# EAGLE design MPeV6 (EAGLE 7.5.0)
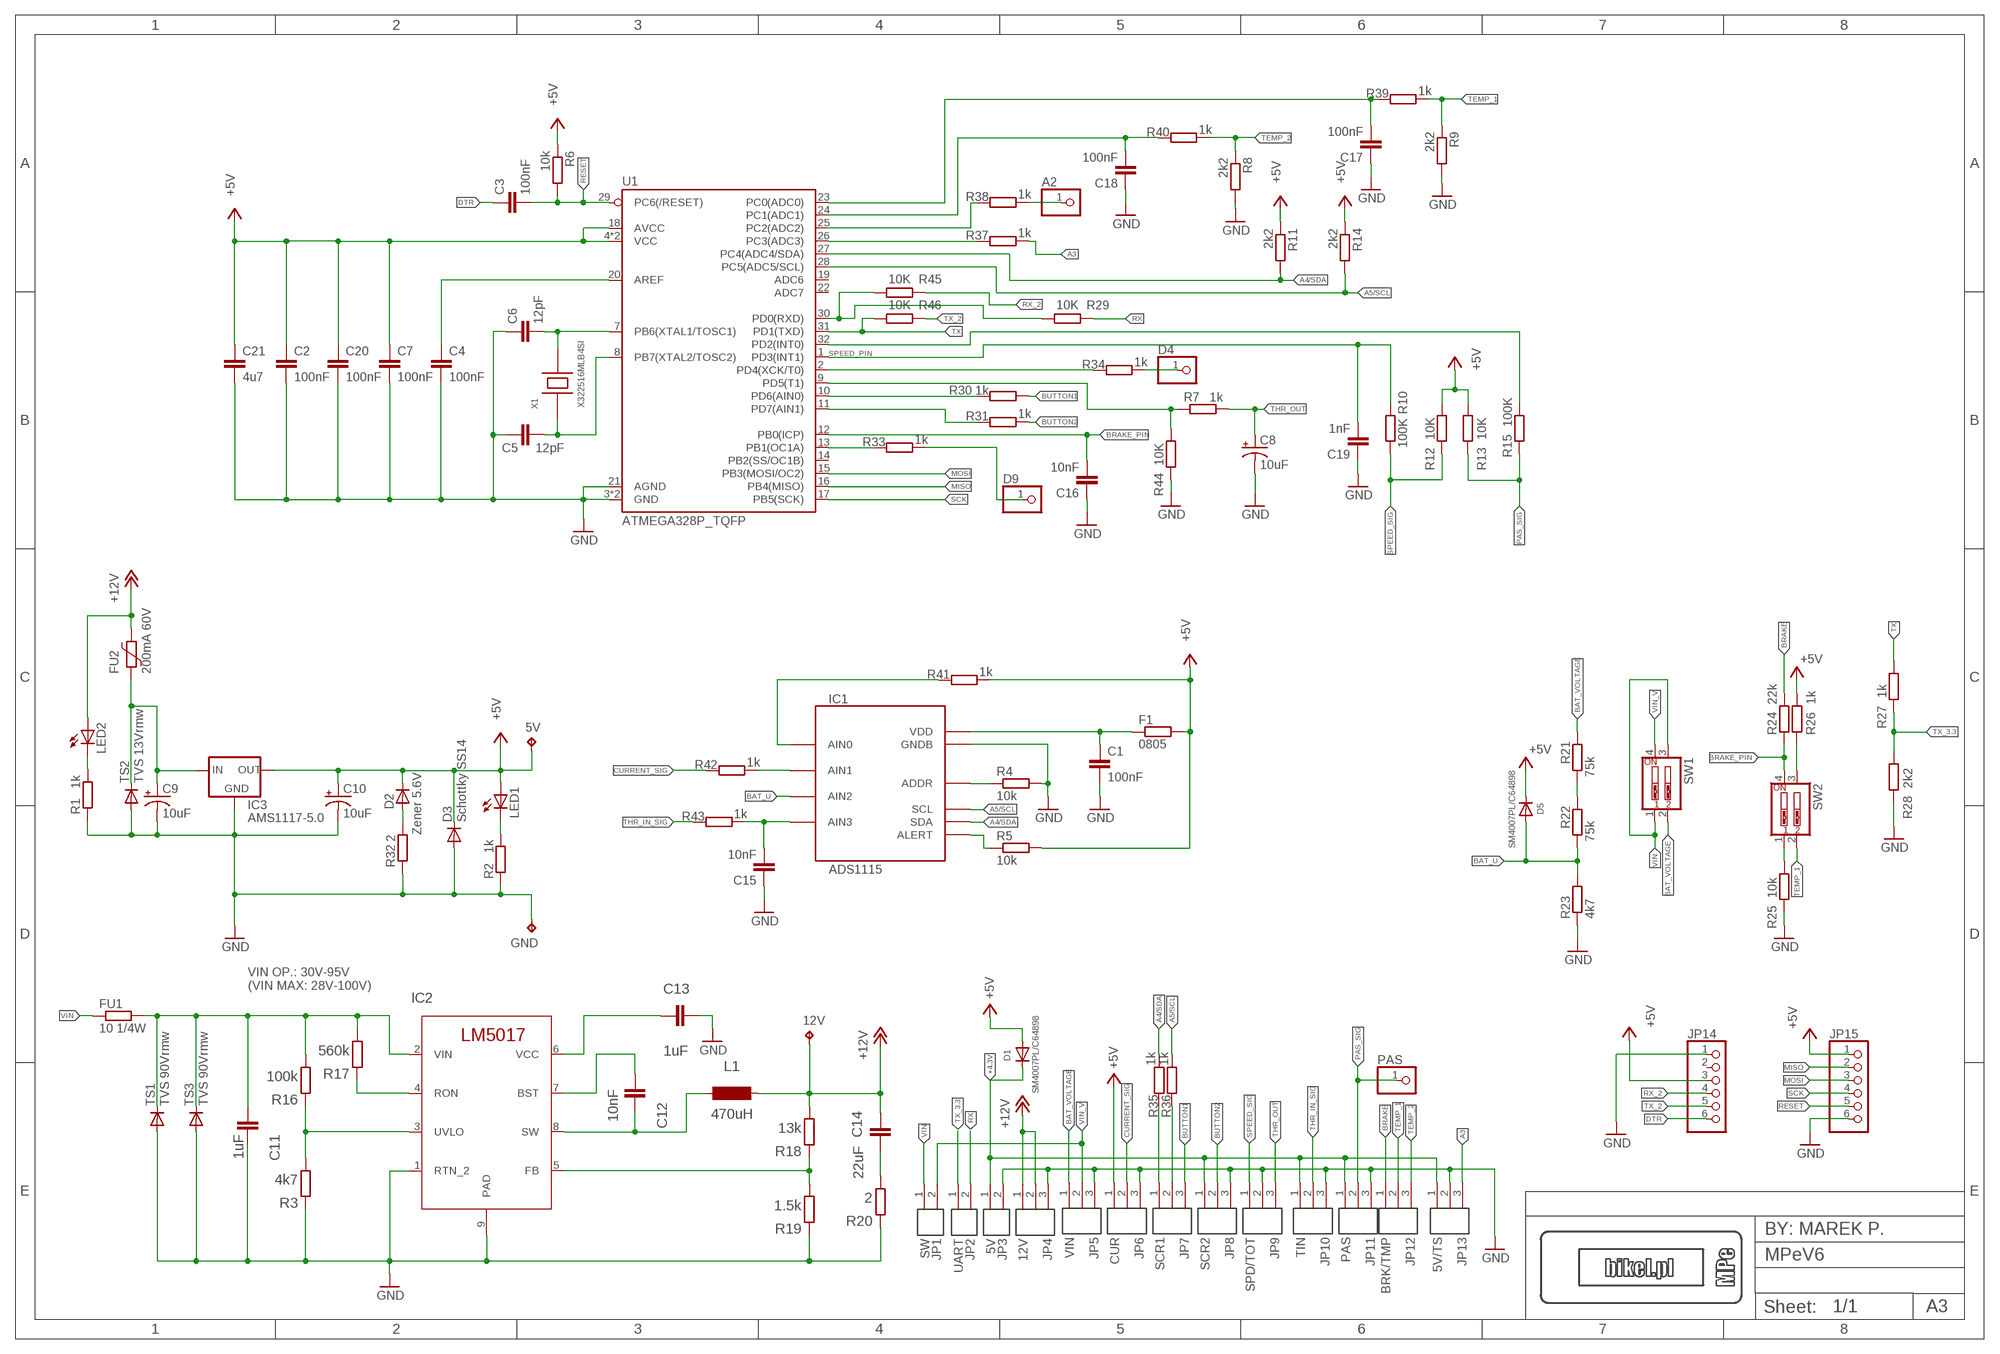
[diagram p0: schematic, sheet 1]

## Parts
5V  TP_5V  TPPAD1-13  [P1-13]
12V  TP_5V  TPPAD1-13  [P1-13]
A2  PINHD-1X1  [1X01]
C1  100nF  C-EUC0603  [C0603]
C2  100nF  C-EUC0603  [C0603]
C3  100nF  C-EUC0603  [C0603]
C4  100nF  C-EUC0603  [C0603]
C5  12pF  C-EUC0603  [C0603]
C6  12pF  C-EUC0603  [C0603]
C7  100nF  C-EUC0603  [C0603]
C8  10uF  10UF-POLAR-EIA3216-16V-10%(TANT)  [EIA3216]
C9  10uF  10UF-POLAR-EIA3216-16V-10%(TANT)  [EIA3216]
C10  10uF  10UF-POLAR-EIA3216-16V-10%(TANT)  [EIA3216]
C11  1uF  C-EUC1206  [C1206]
C12  10nF  C-EUC0805  [C0805]
C13  1uF  C-EUC0603  [C0603]
C14  22uF  C-EUC0805  [C0805]
C15  10nF  C-EUC0603  [C0603]
C16  10nF  C-EUC0603  [C0603]
C17  100nF  C-EUC0603  [C0603]
C18  100nF  C-EUC0603  [C0603]
C19  1nF  C-EUC0603  [C0603]
C20  100nF  C-EUC0603  [C0603]
C21  4u7  C-EUC0603  [C0603]
D1  SM4007PL/C64898  DIODESOD-123  [SOD-123]
D2  Zener 5.6V  D-MLL-34  [MELF-MLL34]
D3  Schottky SS14  DIODE-DO-214AC  [DO-214AC]
D4  PINHD-1X1  [1X01]
D5  SM4007PL/C64898  DIODESOD-123  [SOD-123]
D9  PINHD-1X1  [1X01]
F1  0805  R-EU_R0805  [R0805]
FU1  10 1/4W  R-EU_0204/7  [0204/7]
FU2  200mA 60V  1812L050/30  [1812L]
GND  TP_5V  TPPAD1-13  [P1-13]
IC1  ADS1115  ADS1015IDGT  [MSOP10_0.5]
IC2  LM5017MR/NOPB  [MRA08A]
IC3  AMS1117-5.0  LM1117MP-5.0  [SOT223]
JP1  SW  ARK254-2PB+  [ARK254-PB+]
JP2  UART  ARK254-2ARK254-2-COM  [ARK254-2-COM]
JP3  5V  ARK254-2ARK254-2-5V  [ARK254-2-5V]
JP4  12V  ARK254-3ARK254-3-12V-EL  [ARK254-3-12V-EL]
JP5  VIN  ARK254-3ARK254-3-VIN  [ARK254-3-VIN]
JP6  CUR  ARK254-3+S-  [ARK254-3+S-]
JP7  SCR1  ARK254-3  [ARK254-3]
JP8  SCR2  ARK254-3  [ARK254-3]
JP9  SPD/TOT  ARK254-3ARK254-3-SPD-TOT  [ARK254-3-SPD-TOT]
JP10  TIN  ARK254-3+S-  [ARK254-3+S-]
JP11  PAS  ARK254-3+S-  [ARK254-3+S-]
JP12  BRK/TMP  ARK254-3ARK254-3-BRK-TMP  [ARK254-3-BRK-TMP]
JP13  5V/TS  ARK254-3ARK254-3-5V-TS  [ARK254-3-5V-TS]
JP14  PINHD-1X6  [1X06]
JP15  PINHD-1X6  [1X06]
L1  470uH  SLF12555T-102MR34-PF  [SLF12555T-102MR34-PF]
LED1  LEDCHIP-LED0805  [CHIP-LED0805]
LED2  LEDCHIP-LED0805  [CHIP-LED0805]
PAS  PINHD-1X1  [1X01]
R1  1k  R-EU_R0603  [R0603]
R2  1k  R-EU_R0603  [R0603]
R3  4k7  R-EU_R0603  [R0603]
R4  10k  R-EU_R0603  [R0603]
R5  10k  R-EU_R0603  [R0603]
R6  10k  R-EU_R0603  [R0603]
R7  1k  R-EU_R0603  [R0603]
R8  2k2  R-EU_R0603  [R0603]
R9  2k2  R-EU_R0603  [R0603]
R10  100K  R-EU_R0603  [R0603]
R11  2k2  R-EU_R0603  [R0603]
R12  10K  R-EU_R0603  [R0603]
R13  10K  R-EU_R0603  [R0603]
R14  2k2  R-EU_R0603  [R0603]
R15  100K  R-EU_R0603  [R0603]
R16  100k  R-EU_R0603  [R0603]
R17  560k  R-EU_R0603  [R0603]
R18  13k  R-EU_R0603  [R0603]
R19  1.5k  R-EU_R0603  [R0603]
R20  2  R-EU_R0805  [R0805]
R21  75k  R-EU_R0805  [R0805]
R22  75k  R-EU_R0805  [R0805]
R23  4k7  R-EU_R0805  [R0805]
R24  22k  R-EU_R0603  [R0603]
R25  10k  R-EU_R0603  [R0603]
R26  1k  R-EU_R0603  [R0603]
R27  1k  R-EU_R0603  [R0603]
R28  2k2  R-EU_R0603  [R0603]
R29  10K  R-EU_R0603  [R0603]
R30  1k  R-EU_R0603  [R0603]
R31  1k  R-EU_R0603  [R0603]
R32  2  R-EU_R0805  [R0805]
R33  1k  R-EU_R0603  [R0603]
R34  1k  R-EU_R0603  [R0603]
R35  1k  R-EU_R0603  [R0603]
R36  1k  R-EU_R0603  [R0603]
R37  1k  R-EU_R0603  [R0603]
R38  1k  R-EU_R0603  [R0603]
R39  1k  R-EU_R0603  [R0603]
R40  1k  R-EU_R0603  [R0603]
R41  1k  R-EU_R0603  [R0603]
R42  1k  R-EU_R0603  [R0603]
R43  1k  R-EU_R0603  [R0603]
R44  10K  R-EU_R0603  [R0603]
R45  10K  R-EU_R0603  [R0603]
R46  10K  R-EU_R0603  [R0603]
SW1  SW_DIP-2  [EDG-02]
SW2  SW_DIP-2  [EDG-02]
TS1  TVS 90Vrmw  S2A  [DO214AA]
TS2  TVS 13Vrmw  S2A  [DO214AA]
TS3  TVS 90Vrmw  S2A  [DO214AA]
U1  ATMEGA328P_TQFP  [TQFP32-08]
X1  X322516MLB4SI  SMAC-3225  [IQG3225]

## Nets
3: IC2.5(FB) R18.2 R19.1
6: C13.2 IC2.6(VCC)
7: IC2.4(RON) R17.2
9: C14.2 R20.1
12V_FUSED: C9.+ FU2.2 IC3.3(IN) TS2.C
+4.3V: D1.C JP3.1 JP8.1 JP10.1 JP11.1 JP13.1
+5V: 5V.TP C2.1 C7.1 C10.+ C20.1 C21.1 D1.A D2.1(C) D3.C D5.C F1.2 IC3.2(OUT) IC3.4(OUT) JP6.1 JP14.3 JP15.1 LED1.A R5.2 R6.1 R11.1 R12.2 R13.2 R14.1 R26.2 R41.1 U1.4(VCC) U1.6(VCC) U1.18(AVCC)
+12V: 12V.TP C14.1 FU2.1 JP4.1 JP4.2 L1.P$2 LED2.A R18.1
A2: R38.2 U1.25(PC2(ADC2))
A3: JP13.3 R37.1
A4/SDA: IC1.9(SDA) R11.2 R35.1 U1.27(PC4(ADC4/SDA))
A5/SCL: IC1.10(SCL) R14.2 R36.1 U1.28(PC5(ADC5/SCL))
BAT_U: D5.A IC1.6(AIN2) R22.1 R23.2
BAT_VOLTAGE: JP5.1 R21.2 SW1.2
BRAKE: JP12.1 R24.2
BRAKE_PIN: C16.2 R24.1 SW2.4 U1.12(PB0(ICP))
BUTTON1: JP7.3 R30.1
BUTTON2: JP8.2 R31.1
CSIG: IC1.5(AIN1) R42.1
CURRENT_SIG: JP6.2 R42.2
DTR: C3.1 JP14.6
GND: C1.2 C2.2 C4.2 C5.1 C6.1 C7.2 C8.- C9.- C10.- C11.2 C13.1 C15.1 C16.1 C17.1 C18.1 C19.1 C20.2 C21.2 D3.A GND.TP IC1.3(GNDB) IC2.1(RTN_2) IC2.9(PAD) IC3.1(GND) JP3.2 JP4.3 JP5.3 JP6.3 JP8.3 JP9.2 JP10.3 JP11.3 JP13.2 JP14.1 JP15.6 R1.1 R2.1 R3.2 R4.2 R8.2 R9.2 R19.2 R20.2 R23.1 R25.1 R28.1 R32.1 R44.1 TS1.A TS2.A TS3.A U1.3(GND) U1.5(GND) U1.21(AGND)
MISO: JP15.2 U1.16(PB4(MISO))
MOSI: JP15.3 U1.15(PB3(MOSI/OC2))
N$1: LED1.C R2.2
N$2: JP7.1 R35.2
N$3: IC2.3(UVLO) R3.1 R16.2
N$4: JP7.2 R36.2
N$5: D9.1 R33.1
N$6: C12.1 IC2.7(BST)
N$7: R7.1 R44.2 U1.9(PD5(T1))
N$8: C4.1 U1.20(AREF)
N$9: LED2.C R1.2
N$10: R15.2 U1.32(PD2(INT0))
N$11: IC1.1(ADDR) R4.1
N$12: IC1.2(ALERT) R5.1
N$13: D4.1 R34.1
N$15: IC1.4(AIN0) R41.2
N$17: R29.2 R45.2 U1.30(PD0(RXD))
N$18: D2.2(A) R32.2
N$19: R25.2 SW2.1
N$20: R30.2 U1.10(PD6(AIN0))
N$21: R31.2 U1.11(PD7(AIN1))
N$22: R26.1 SW2.3
N$23: C11.1 FU1.2 IC2.2(VIN) R16.1 R17.1 TS1.C TS3.C
N$24: R33.2 U1.13(PB1(OC1A))
N$25: R34.2 U1.2(PD4(XCK/T0))
N$26: C6.2 U1.7(PB6(XTAL1/TOSC1)) X1.3(PIN2)
N$27: C5.2 U1.8(PB7(XTAL2/TOSC2)) X1.1(PIN1)
N$30: R21.1 R22.2
N$31: R37.2 U1.26(PC3(ADC3))
N$32: A2.1 R38.1
PAS_SIG: JP11.2 PAS.1 R13.1 R15.1
RESET: C3.2 JP15.5 R6.2 U1.29(PC6(/RESET))
RX: JP2.2 R29.1
RX_2: JP14.4 R45.1
SCK: JP15.4 U1.17(PB5(SCK))
SPEED_PIN: C19.2 R10.2 U1.1(PD3(INT1))
SPEED_SIG: JP9.1 R10.1 R12.1
SW: C12.2 IC2.8(SW) L1.P$1
T1: C17.2 R39.2 U1.23(PC0(ADC0))
T2: C18.2 R40.2 U1.24(PC1(ADC1))
TEMP_1: JP12.2 R9.1 R39.1 SW2.2
TEMP_2: JP12.3 R8.1 R40.1
THR_IN_SIG: JP10.2 R43.2
THR_OUT: C8.+ JP9.3 R7.2
TSIG: C15.2 IC1.7(AIN3) R43.1
TX: R27.2 R46.2 U1.31(PD1(TXD))
TX_2: JP14.5 R46.1
TX_3.3: JP2.1 R27.1 R28.2
VDD: C1.1 F1.1 IC1.8(VDD)
VIN: FU1.1 JP1.1 SW1.1 SW1.3
VIN_V: JP1.2 JP5.2 SW1.4
Unconnected: JP14.2 U1.14(PB2(SS/OC1B)) U1.19(ADC6) U1.22(ADC7)

## Notes on the sheet
- VIN OP.: 30V-95V
  (VIN MAX: 28V-100V)

## Library data of the parts
5V 12V GND = testpad:TP: Test pad
A2 D4 D9 PAS = pinhead:PINHD-1X1: PIN HEADER
C1-C7 C11-C21 = resistor:C-EU: CAPACITOR, European symbol
C8-C10 = SparkFun-Capacitors:10UF-POLAR: 10.0µF polarized capacitors A capacitor is a passive two-terminal electrical component used to store electrical energy temporarily in an electric field.; PROD_ID: CAP-00811
D1 D5 = adafruit:DIODE: Diode SMADIODE - SMA Surface Mount Package 20V 1A Schottky Diode Digikey: 641-1014-6-ND DO-1N4148 - Through Hole Small Current Diode SOD-123 20V 1 A (.5mV Vf) Schottky Diode - Digikey: MBRX120TPMSCT-ND SOD-323 10V 570mA (.38mV Vf, 3ns) Schottky Diode - Digikey: ZLLS410CT-ND SOD-523 30V 30mA Schottky Diode (RB751S-40TE61) - Digikey: RB751S-40TE61CT-ND SOT23-R/W - SOT23 Package (R = Solder Paste/Reflow Ovens, W = Hand-Soldering) BAT54Film 40V 300mA - Digikey: 497-7162-1-ND
D2 = semicon-smd-ipc:D-: DIODE unfilled
D3 = diode:DIODE-: DIODE
F1 FU1 R1-R46 = resistor:R-EU_: RESISTOR, European symbol
FU2 = polyfuse-smd_10:?: Polyfuse Resettable PTC Source: http://www.littelfuse.com/products/resettable-ptcs.aspx; MF: Littelfuse; MPN: 1812L050/30; OC_FARNELL: 2383301; OC_NEWARK: 64R8225
IC1 = bt_adc:ADS1015: Ti ADS1015 12-bit ADC Ultra-Small, Low-Power, 12-Bit Analog-to-Digital Converter with Internal Reference The ADS1013, ADS1014, and ADS1015 are precision analog-to-digital converters (ADCs) with 12 bits of resolution offered in an ultra-small, leadless QFN-10 package or an MSOP-10 package. \ Source: http://focus.ti.com/docs/prod/folders/print/ads1015.html
IC2 = _LM5017_export:LM5017MR/NOPB; DATASHEETURL: httpwww.ti.comproductlm34927; FREQUENCY: 1000000.0; IMAX: 0.6; MANUFACTURER_NAME: Texas Instruments; MANUFACTURER_PART_NUMBER: LM5017MRNOPB; MKTG_PACKAGE: NA; NSID: LM5017SDNOPB; PACKAGE: NA; VENDOR: Texas Instruments
IC3 = lm1117:LM1117?-*: 800mA Low-Dropout Linear Regulator Source: http://ww1.microchip.com/downloads/en/DeviceDoc/39760d.pdf; MF: Texas Instruments; MPN: LM1117MP-5.0; OC_FARNELL: 9778209; OC_NEWARK: 28X3417
JP1-JP3 = _marek:ARK254-2
JP4-JP13 = _marek:ARK254-3
JP14 JP15 = pinhead:PINHD-1X6: PIN HEADER
L1 = _marek:SLF12555T-102MR34-PF; LCSC: C13738
LED1 LED2 = adafruit:LED: LED OSRAM: - CHIPLED LG R971, LG N971, LY N971, LG Q971, LY Q971, LO R971, LY R971 LH N974, LH R974 LS Q976, LO Q976, LY Q976 LO Q996 - Hyper CHIPLED LW Q18S LB Q993, LB Q99A, LB R99A - SideLED LS A670, LO A670, LY A670, LG A670, LP A670 LB A673, LV A673, LT A673, LW A673 LH A674 LY A675 LS A676, LA A676, LO A676, LY A676, LW A676 LS A679, LY A679, LG A679 - Hyper Micro SIDELED® LS Y876, LA Y876, LO Y876, LY Y876 LT Y87S - SmartLED LW L88C, LW L88S LB L89C, LB L89S, LG L890 LS L89K, LO L89K, LY L89K LS L896, LA L896, LO L896, LY L896 - TOPLED LS T670, LO T670, LY T670, LG T670, LP T670 LSG T670, LSP T670, LSY T670, LOP T670, LYG T670 LG T671, LOG T671, LSG T671 LB T673, LV T673, LT T673, LW T673 LH T674 LS T676, LA T676, LO T676, LY T676, LB T676, LH T676, LSB T676, LW T676 LB T67C, LV T67C, LT T67C, LS T67K, LO T67K, LY T67K, LW E67C LS E67B, LA E67B, LO E67B, LY E67B, LB E67C, LV E67C, LT E67C LW T67C LS T679, LY T679, LG T679 LS T770, LO T770, LY T770, LG T770, LP T770 LB T773, LV T773, LT T773, LW T773 LH T774 LS E675, LA E675, LY E675, LS T675 LS T776, LA T776, LO T776, LY T776, LB T776 LHGB T686 LT T68C, LB T68C - Hyper Mini TOPLED® LB M676 - Mini TOPLED Santana® LG M470 LS M47K, LO M47K, LY M47K Source: http://www.osram.convergy.de/
SW1 SW2 = special:SW_DIP-2: DIP SWITCH
TS1-TS3 = s2x_10:S2*: S2A - S2M General Purpose Rectifiers Source: http://www.fairchildsemi.com/datasheets/S2/S2A.pdf; MF: Fairchild; MPN: S2A; OC_FARNELL: 1467485; OC_NEWARK: 58K2391
U1 = SparkFun-IC-Microcontroller:ATMEGA328P_TQFP: Popular 328P in QFP Storefront component: ATmega328 - TQFP <https://www.sparkfun.com/products/13448> (COM-13448) Datasheet <http://www.sparkfun.com/datasheets/Components/SMD/ATMega328.pdf> SparkFun Products SparkFun RedBoard - Programmed with Arduino <https://www.sparkfun.com/products/12757> (DEV-12757) Arduino Pro Mini 328 - 5V/16MHz <https://www.sparkfun.com/products/11113> (DEV-11113) Arduino Pro Mini 328 - 3.3V/8MHz <https://www.sparkfun.com/products/11114> (DEV-11114) SparkFun OpenLog <https://www.sparkfun.com/products/13712> (DEV-13712) SparkFun MicroView - OLED Arduino Module <https://www.sparkfun.com/products/12923> (DEV-12923) SparkFun Digital Sandbox <https://www.sparkfun.com/products/12651> (DEV-12651) SparkFun PicoBoard <https://www.sparkfun.com/products/11888> (WIG-11888) Arduino Fio <https://www.sparkfun.com/products/10116> (DEV-10116) LilyPad Arduino 328 Main Board <https://www.sparkfun.com/products/13342> (DEV-13342) SparkFun RedStick <https://www.sparkfun.com/products/13741> (DEV-13741) LilyPad MP3 <https://www.sparkfun.com/products/11013> (DEV-11013) LilyPad Arduino SimpleSnap <https://www.sparkfun.com/products/10941> (DEV-10941) SparkFun Stepoko <https://www.sparkfun.com/products/13899> (ROB-13899) SparkFun Geiger Counter <https://www.sparkfun.com/products/11345> (SEN-11345) SparkFun EL Sequencer <https://www.sparkfun.com/products/12781> (COM-12781) Arduino Pro 328 - 5V/16MHz <https://www.sparkfun.com/products/10915> (DEV-10915) CryptoCape <https://www.sparkfun.com/products/12773> (DEV-12773) SparkFun IR Thermometer Evaluation Board - MLX90614 <https://www.sparkfun.com/products/10740> (SEN-10740) SparkFun RedBot Mainboard <https://www.sparkfun.com/products/12097> (ROB-12097) Arduino Pro 328 - 3.3V/8MHz <https://www.sparkfun.com/products/10914> (DEV-10914) SparkFun Block for Intel® Edison - Arduino <https://www.sparkfun.com/products/13036> (DEV-13036) SparkFun Simon Says - Surface Mount Soldering Kit <https://www.sparkfun.com/products/10935> (KIT-10935) SparkFun 7-Segment Serial Display - Red <https://www.sparkfun.com/products/11441> (COM-11441) SparkFun 7-Segment Serial Display - White <https://www.sparkfun.com/products/11629> (COM-11629) SparkFun 7-Segment Serial Display - Yellow <https://www.sparkfun.com/products/11443> (COM-11443) SparkFun 7-Segment Serial Display - Kelly Green <https://www.sparkfun.com/products/11440> (COM-11440) SparkFun 7-Segment Serial Display - Blue <https://www.sparkfun.com/products/11442> (COM-11442) SparkFun OpenSegment Serial Display - 20mm (Blue) <https://www.sparkfun.com/products/11647> (COM-11647) SparkFun OpenSegment Serial Display - 20mm (Green) <https://www.sparkfun.com/products/11646> (COM-11646) SparkFun OpenSegment Serial Display - 20mm (White) <https://www.sparkfun.com/products/11648> (COM-11648) SparkFun OpenSegment Serial Display - 20mm (Red) <https://www.sparkfun.com/products/11644> (COM-11644) SparkFun OpenSegment Serial Display - 20mm (Yellow) <https://www.sparkfun.com/products/11645> (COM-11645) SparkFun OpenSegment Shield <https://www.sparkfun.com/products/13190> (DEV-13190); PROD_ID: IC-09069
X1 = interquip:SMAC-3225: All Ceramic SMD Package SMAC-3225 4Pads Pb-Free, RoHs Compliant Company Website:http://www.interquip.com/

## Board
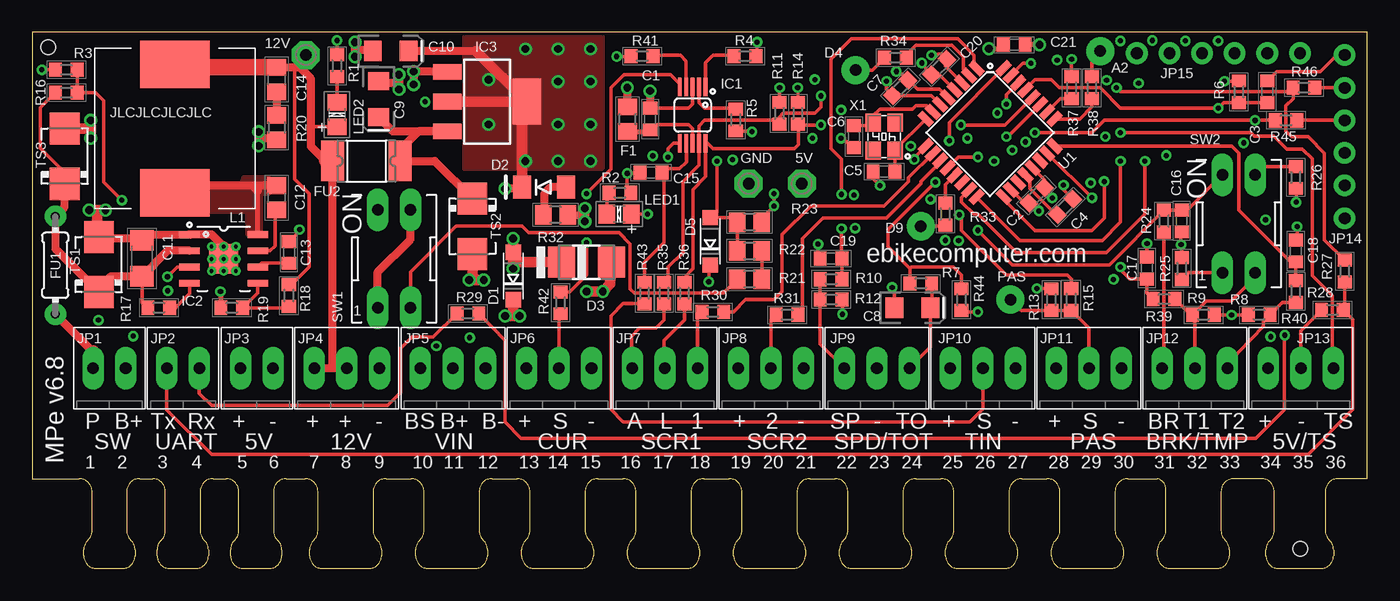
[diagram p1: board, top side]
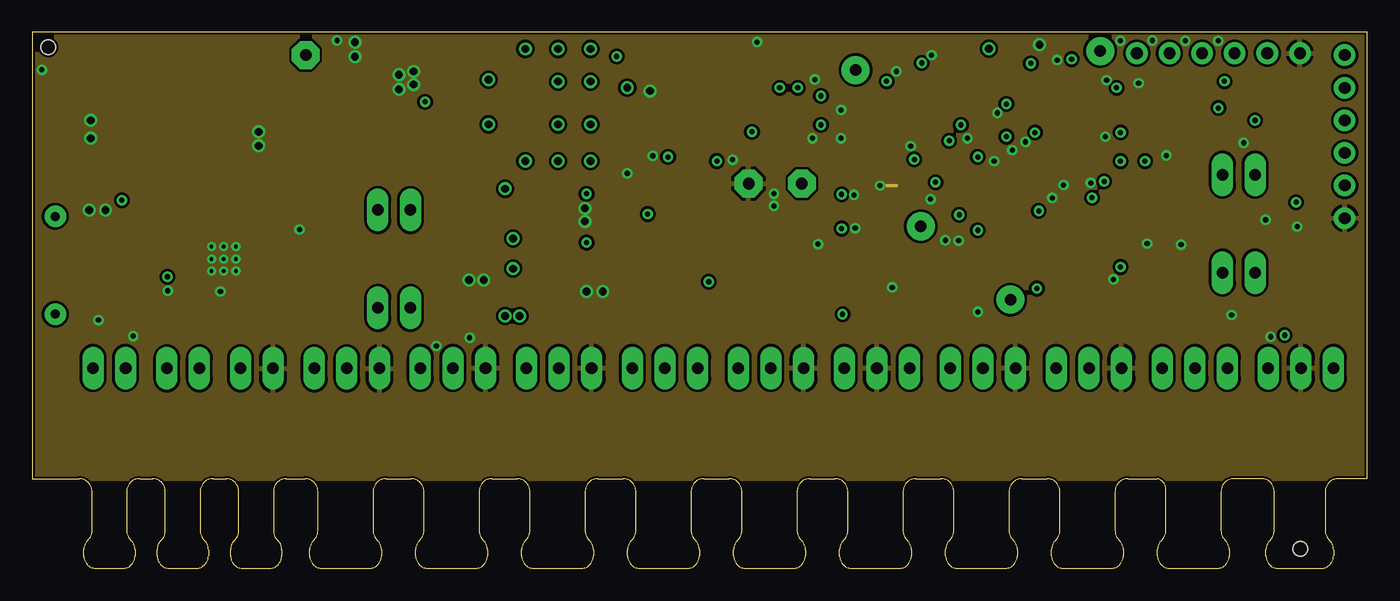
[diagram p2: board, inner layer GND]
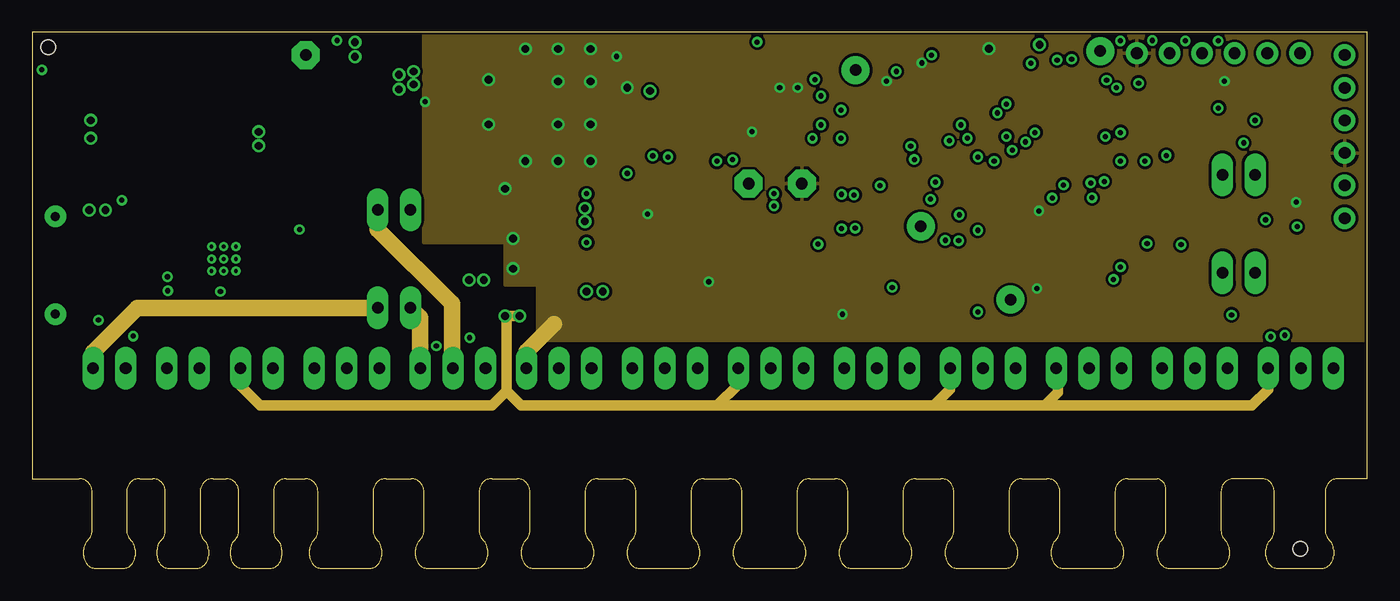
[diagram p3: board, inner layer Power_5V]
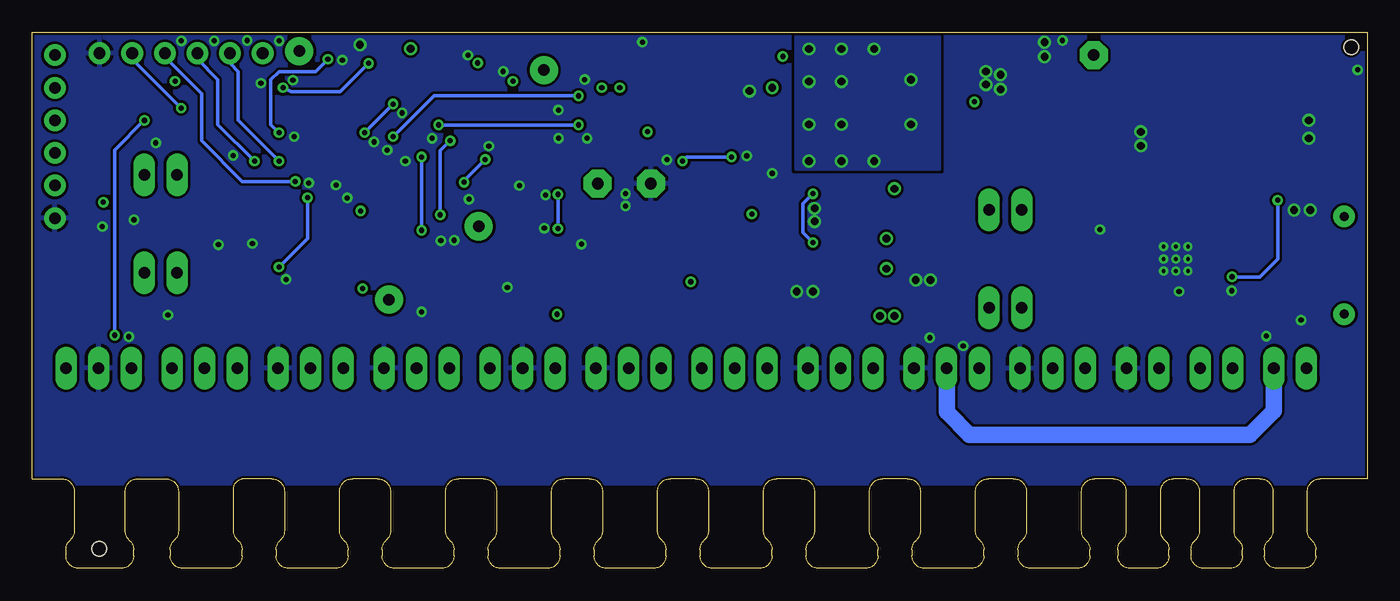
[diagram p4: board, bottom side, seen from below]

Size 104 x 41.8 mm. Coordinates in mm from the lower left corner, seen from the top.
Outline: 104,7 104,41.8 0,41.8 0,7 3.67,7 arc-90 4.67,6 4.67,2.94 arc-48 4.34,2.2 arc48 4.02,1.46 4.02,1 arc90 5.02,0 7.02,0 arc90 8.02,1 8.02,1.46 arc48 7.69,2.2 arc-48 7.37,2.94 7.37,6 arc-90 8.37,7 9.38,7 arc-90 10.38,6 10.38,2.94 arc-48 10.06,2.2 arc48 9.73,1.46 9.73,1 arc90 10.73,0 12.73,0 arc90 13.73,1 13.73,1.46 arc48 13.41,2.2 arc-48 13.08,2.94 13.08,6 arc-90 14.08,7 15.1,7 arc-90 16.1,6 16.1,2.94 arc-48 15.77,2.2 arc48 15.45,1.46 15.45,1 arc90 16.45,0 18.45,0 arc90 19.45,1 19.45,1.46 arc48 19.12,2.2 arc-48 18.8,2.94 18.8,6 arc-90 19.8,7 21.26,7 arc-90 22.26,6 22.26,2.94 arc-48 21.94,2.2 arc48 21.61,1.46 21.61,1 arc90 22.61,0 26.21,0 arc90 27.21,1 27.21,1.46 arc48 26.89,2.2 arc-48 26.56,2.94 26.56,6 arc-90 27.56,7 29.52,7 arc-90 30.52,6 30.52,2.94 arc-48 30.19,2.2 arc48 29.87,1.46 29.87,1 arc90 30.87,0 34.47,0 arc90 35.47,1 35.47,1.46 arc48 35.14,2.2 arc-48 34.82,2.94 34.82,6 arc-90 35.82,7 37.77,7 arc-90 38.77,6 38.77,2.94 arc-48 38.45,2.2 arc48 38.12,1.46 38.12,1 arc90 39.12,0 42.72,0 arc90 43.72,1 43.72,1.46 arc48 43.4,2.2 arc-48 43.07,2.94 43.07,6 arc-90 44.07,7 46.03,7 arc-90 47.03,6 47.03,2.94 arc-48 46.7,2.2 arc48 46.38,1.46 46.38,1 arc90 47.38,0 50.98,0 arc90 51.98,1 51.98,1.46 arc48 51.65,2.2 arc-48 51.33,2.94 51.33,6 arc-90 52.33,7 54.28,7 arc-90 55.28,6 55.28,2.94 arc-48 54.96,2.2 arc48 54.63,1.46 54.63,1 arc90 55.63,0 59.23,0 arc90 60.23,1 60.23,1.46 arc48 59.91,2.2 arc-48 59.58,2.94 59.58,6 arc-90 60.58,7 62.54,7 arc-90 63.54,6 63.54,2.94 arc-48 63.21,2.2 arc48 62.89,1.46 62.89,1 arc90 63.89,0 67.49,0 arc90 68.49,1 68.49,1.46 arc48 68.16,2.2 arc-48 67.84,2.94 67.84,6 arc-90 68.84,7 70.79,7 arc-90 71.79,6 71.79,2.94 arc-48 71.47,2.2 arc48 71.14,1.46 71.14,1 arc90 72.14,0 75.74,0 arc90 76.74,1 76.74,1.46 arc48 76.42,2.2 arc-48 76.09,2.94 76.09,6 arc-90 77.09,7 79.05,7 arc-90 80.05,6 80.05,2.94 arc-48 79.72,2.2 arc48 79.4,1.46 79.4,1 arc90 80.4,0 84,0 arc90 85,1 85,1.46 arc48 84.67,2.2 arc-48 84.35,2.94 84.35,6 arc-90 85.35,7 87.62,7 arc-90 88.3,6 88.3,2.94 arc-48 87.98,2.2 arc48 87.65,1.46 87.65,1 arc90 88.65,0 92.25,0 arc90 93.25,1 93.25,1.46 arc48 92.93,2.2 arc-48 92.6,2.94 92.6,6 arc-90 93.6,7 95.74,7 arc-90 96.74,6 96.74,2.94 arc-48 96.42,2.2 arc48 96.09,1.46 96.09,1 arc90 97.09,0 100.36,0 arc90 101.36,1 101.36,1.46 arc48 101.04,2.2 arc-48 100.71,2.94 100.71,6 arc-90 101.71,7 104,7
Copper layers (1*2*3*16): Top 0.035mm / dielectric 0.2mm / GND 0.035mm / dielectric 1.065mm / Power_5V 0.035mm / dielectric 0.2mm / Bottom 0.035mm
Design rules "default *": minimum track width 5mil, minimum drill 0.2mm, track to track 5mil, track to pad 5mil, pad to pad 5mil, via to via 5mil, smd to smd 5mil, copper to edge 8mil, drill to drill 8mil, minimum pad ring 10mil, minimum via ring 8mil, stop-mask expansion 4mil, vias tented up to drill 0.6mm, thermal gap 10mil
Holes 1.15 mm at 1.27,40.64 98.77,1.53

### Footprints (pad centres in the part's own frame; a part is rotated, then mirrored left to right if it is on the bottom)
P1-13 = drill 0.9 pad 2.159 octagon: TP 0,0
1X01 = drill 0.9 pad 2.184: 1 0,0
C0603 = smd 1 x 1.1: 1 -0.85,0; 2 0.85,0
EIA3216 = smd 1.4 x 1.6: + 1.4,0; - -1.4,0
C1206 = smd 1.6 x 1.8: 1 -1.4,0; 2 1.4,0
C0805 = smd 1.3 x 1.5: 1 -0.95,0; 2 0.95,0
SOD-123 = smd 1.2 x 1.2: A 1.85,0; C -1.85,0
MELF-MLL34 = smd 1.4 x 1.8: 1 -1.7,0; 2 1.7,0
DO-214AC = smd 2.1 x 2.4: A 1.95,0; C -1.95,0
R0805 = smd 1.3 x 1.5: 1 -0.95,0; 2 0.95,0
0204/7 = drill 0.7 pad 1.676: 1 -3.81,0; 2 3.81,0
1812L = smd 1.78 x 3.15: 1 -2.62,0; 2 2.62,0
MSOP10_0.5 = smd 0.3 x 1.45: 1 -1,-2.2; 2 -0.5,-2.2; 3 0,-2.2; 4 0.5,-2.2; 5 1,-2.2; 6 1,2.2; 7 0.5,2.2; 8 0,2.2; 9 -0.5,2.2; 10 -1,2.2
MRA08A = smd 1.6 x 0.533: 1 -2.654,1.905; 2 -2.654,0.635; 3 -2.654,-0.635; 4 -2.654,-1.905; 5 2.654,-1.905; 6 2.654,-0.635; 7 2.654,0.635; 8 2.654,1.905 | smd 2.286 x 2.286: 9 0,0
SOT223 = smd 1.219 x 2.235: 1 -2.311,-3.099; 2 0,-3.099; 3 2.311,-3.099 | smd 3.6 x 2.2: 4 0,3.099
ARK254-PB+ = drill 0.9 pad 1.676 long: 1 -1.27,0; 2 1.27,0
ARK254-2-COM = drill 0.9 pad 1.676 long: 1 -1.27,0; 2 1.27,0
ARK254-2-5V = drill 0.9 pad 1.676 long: 1 -1.27,0; 2 1.27,0
ARK254-3-12V-EL = drill 0.9 pad 1.676 long: 1 -2.54,0; 2 0,0; 3 2.54,0
ARK254-3-VIN = drill 0.9 pad 1.676 long: 1 -2.54,0; 2 0,0; 3 2.54,0
ARK254-3+S- = drill 0.9 pad 1.676 long: 1 -2.54,0; 2 0,0; 3 2.54,0
ARK254-3 = drill 0.9 pad 1.676 long: 1 -2.54,0; 2 0,0; 3 2.54,0
ARK254-3-SPD-TOT = drill 0.9 pad 1.676 long: 1 -2.54,0; 2 0,0; 3 2.54,0
ARK254-3-BRK-TMP = drill 0.9 pad 1.676 long: 1 -2.54,0; 2 0,0; 3 2.54,0
ARK254-3-5V-TS = drill 0.9 pad 1.676 long: 1 -2.54,0; 2 0,0; 3 2.54,0
1X06 = drill 0.9 pad 1.676: 1 -6.35,0; 2 -3.81,0; 3 -1.27,0; 4 1.27,0; 5 3.81,0; 6 6.35,0
SLF12555T-102MR34-PF = smd 3.7 x 5.4: P$1 -5,0; P$2 5,0
CHIP-LED0805 = smd 1.5 x 1.3: A 0,-0.95; C 0,0.95
R0603 = smd 1 x 1.1: 1 -0.85,0; 2 0.85,0
EDG-02 = drill 0.9 pad 1.676 long: 1 -1.27,-3.81; 2 1.27,-3.81; 3 1.27,3.81; 4 -1.27,3.81
DO214AA = smd 2.5 x 2.3: A 2.15,0; C -2.15,0
TQFP32-08 = smd 1.27 x 0.559: 1 -4.293,2.8; 2 -4.293,2; 3 -4.293,1.2; 4 -4.293,0.4; 5 -4.293,-0.4; 6 -4.293,-1.2; 7 -4.293,-2; 8 -4.293,-2.8; 17 4.293,-2.8; 18 4.293,-2; 19 4.293,-1.2; 20 4.293,-0.4; 21 4.293,0.4; 22 4.293,1.2; 23 4.293,2; 24 4.293,2.8 | smd 0.559 x 1.27: 9 -2.8,-4.293; 10 -2,-4.293; 11 -1.2,-4.293; 12 -0.4,-4.293; 13 0.4,-4.293; 14 1.2,-4.293; 15 2,-4.293; 16 2.8,-4.293; 25 2.8,4.293; 26 2,4.293; 27 1.2,4.293; 28 0.4,4.293; 29 -0.4,4.293; 30 -1.2,4.293; 31 -2,4.293; 32 -2.8,4.293
IQG3225 = smd 1.4 x 1.2: 1 -1.1,-0.85; 2 1.1,-0.85; 3 1.1,0.85; 4 -1.1,0.85

### Placement (x,y rotation side)
5V  59.96,29.99 0 top
12V  21.31,40 0 top
A2  83.19,40.32 0 top
C1  48.15,35.02 90 top
C2  78.23,29.08 45 top
C3  96.2,37.14 270 top
C4  80.47,28.18 45 top
C5  66.36,30.92 0 top
C6  64.01,33.65 90 top
C7  67.63,37.46 45 top
C8  68.58,20.32 0 top
C9  26.99,36.57 270 top
C10  27.94,40.32 0 top
C11  8.56,24.16 90 top
C12  19.05,28.89 90 top
C13  20,24.63 270 top
C14  19.05,38.1 270 top
C15  48.21,30.84 0 top
C16  89.53,27.09 90 top
C17  86.82,23.42 270 top
C18  98.42,24.75 270 top
C19  62.23,24.15 0 top
C20  70.66,39.09 45 top
C21  76.49,40.8 0 top
D1  37.47,22.79 90 top
D2  39.88,29.71 0 top
D3  43.18,23.87 0 top
D4  64.14,38.85 0 top
D5  52.81,25.5 90 top
D9  69.22,26.67 0 top
F1  46.37,35.01 90 top
FU1  1.8,23.63 90 top
FU2  26.04,31.75 0 top
GND  55.8,29.99 0 top
IC1  51.45,35.33 180 top
IC2  14.92,24.13 0 top
IC3  35.43,36.38 270 top
JP1  6.02,15.62 0 top
JP2  11.76,15.6 0 top
JP3  17.5,15.6 0 top
JP4  24.51,15.6 0 top
JP5  32.78,15.62 0 top
JP6  41.03,15.62 0 top
JP7  49.29,15.62 0 top
JP8  57.54,15.62 0 top
JP9  65.8,15.62 0 top
JP10  74.05,15.62 0 top
JP11  82.31,15.62 0 top
JP12  90.56,15.62 0 top
JP13  98.82,15.62 0 top
JP14  102.23,33.65 90 top
JP15  92.39,40.15 0 top
L1  11.11,34.29 90 top
LED1  45.72,27.62 90 top
LED2  23.75,35.37 0 top
PAS  76.2,20.95 0 top
R1  23.75,39.18 270 top
R2  45.78,29.27 180 top
R3  2.67,38.86 180 top
R4  55.52,39.93 0 top
R5  54.8,34.95 270 top
R6  93.98,37.14 270 top
R7  69.22,22.22 0 top
R8  95.57,19.77 180 top
R9  91.24,19.77 0 top
R10  62.23,22.54 0 top
R11  58.22,35.47 270 top
R12  62.23,20.95 0 top
R13  79.38,20.95 90 top
R14  59.64,35.47 270 top
R15  80.92,20.96 90 top
R16  2.67,37.08 0 top
R17  9.87,20.32 0 top
R18  20,21.27 270 top
R19  15.56,20.32 180 top
R20  19.05,34.35 270 top
R21  55.88,22.54 180 top
R22  55.88,24.76 0 top
R23  55.88,26.98 180 top
R24  88.15,27.07 270 top
R25  89.53,23.38 270 top
R26  98.42,30.48 270 top
R27  102.23,23.17 90 top
R28  101.28,20.14 0 top
R29  33.95,19.88 0 top
R30  53.02,20 0 top
R31  58.8,19.77 0 top
R32  40.77,27.56 180 top
R33  71.12,27.62 90 top
R34  67.25,39.81 0 top
R35  49.23,21.46 270 top
R36  50.8,21.46 270 top
R37  80.96,37.46 270 top
R38  82.55,37.46 270 top
R39  88.16,20.99 180 top
R40  98.42,21.59 90 top
R41  47.51,39.93 0 top
R42  41.15,20.7 270 top
R43  47.69,21.46 270 top
R44  72.39,20.95 90 top
R45  97.66,34.92 180 top
R46  99.06,37.46 180 top
SW1  28.19,24.13 0 top
SW2  93.98,26.87 0 top
TS1  5.19,23.68 90 top
TS2  34.29,26.67 270 top
TS3  2.54,32.13 90 top
U1  74.61,33.97 315 top
X1  66.36,33.65 90 top

### Tracks (layer width: path | path; a pad name or v marks a point on that pad's centre or on a via)
3
  Top 0.254: IC2.5 17.58,21.49 R19.1 19.9,20.32 R18.2
6
  Top 0.254: IC2.6 17.87,23.78 C13.2
7
  Top 0.254: IC2.4 12.27,21.45 11.14,20.32
  Top 0.406: R17.2 11.14,20.32
9
  Top 0.61: C14.2 R20.1
12V_FUSED
  Top 0.61: FU2.2 31.36,31.75 TS2.C | 28.26,32.22 30.11,34.07 IC3.3 28.09,34.07 C9.+
  Top 1.016: FU2.2 28.26,32.22
+4.3V  (via drill 0.6)
  Top 0.813: v37.97,19.68 v36.83,19.68 37.47,19.68 D1.C
  Power_5V 0.813: v37.97,19.68 36.96,19.68 36.96,13.84 | 36.96,13.84 35.81,12.7 17.78,12.7 16.23,14.25 JP3.1 | 36.96,13.84 38.1,12.7 53.34,12.7 | 53.34,12.7 55,14.36 JP8.1 | JP10.1 71.5,15.6 71.5,13.97 70.23,12.7 | 70.23,12.7 53.34,12.7 | JP11.1 79.88,15.5 79.88,13.71 78.87,12.7 | 78.87,12.7 70.23,12.7 | JP13.1 96.27,15.6 96.27,13.97 95,12.7 78.87,12.7
+5V  (via drill 0.4, 0.6)
  Top 0.254: U1.6 70.02,36.86 C7.1 66.55,37.34 v66.55,37.97 | 71.68,37.29 U1.4 70.53,38.61 C20.1 69.6,38.95 v69.29,39.39 | U1.18 77.28,28.48 C2.1 77.79,28.48 v78.41,27.86 | LED1.A v47.94,27.62 | R5.2 56.01,34.1 v56.07,34.03 | v52.7,22.35 52.7,23.55 | R11.1 58.22,37.45 v58.23,37.46 | R14.1 59.64,37.45 v59.63,37.46 | R12.2 63.12,20.91 v63.12,19.81 | R13.2 v78.26,21.82 | v98.45,28.55 98.45,29.6 R26.2 | v45.53,39.9 46.66,39.9 R41.1 | 75.35,40.51 C21.1 | v92.86,37.97 93.96,37.97 R6.1
  Top 0.406: 52.7,23.55 D5.C | 75.49,40.48 C21.1 | v74.52,40.51 75.35,40.51
  Top 0.61: 34.59,40.32 C10.+ | D2.1 38.05,29.59 v36.83,29.59 | v46.35,37.46 46.35,35.97 F1.2
  Top 0.813: IC3.2 IC3.4 | IC3.4 34.59,40.32 | 38.18,36.03 IC3.4 | v37.47,23.36 37.47,24.13 | 37.47,24.13 D1.A v37.47,25.71 | D2.1 38.18,36.75 38.1,36.83 | D3.C 37.72,23.87 37.47,24.13
  Power_5V 0.254: v66.55,37.97 66.55,37.84
  Power_5V 1.27: JP6.1 38.49,16.9 40.64,19.05
  other vias: 38.42,40.48 40.96,40.48 43.5,40.48 43.5,37.94 40.96,37.94 43.5,34.6 40.96,34.6 43.5,31.75 40.96,31.75 38.42,31.75 35.56,38.1 35.56,34.6 30.61,36.37
  pour Power_5V (isolate 0.203): 30.48,43.18 105.41,43.18 105.41,17.78 39.37,17.78 39.37,22.09 36.83,22.09 36.83,25.4 30.48,25.4
  pour Top (isolate 0.254, no thermals): 33.66,41.91 44.45,41.91 44.45,31.11 33.66,31.11
  pour Bottom (isolate 0.254): 33.34,41.97 44.51,41.97 44.51,31.11 33.34,31.11
+12V
  Top 0.254: 20.45,39.05 20.45,30.35 21.59,29.21 21.59,23.49 20.22,22.12 R18.1 | LED2.A 21.72,34.42 21.72,34.29
  Top 0.61: C14.1 20.45,39.05 20.83,39.05 | 20.83,39.05 21.72,38.16 21.72,34.29 21.72,32.89 22.86,31.75 | 20.83,39.05 20.83,39.52 12V.TP | JP4.2 23.41,15.6 | 23.41,15.6 JP4.1 | 23.41,15.6 FU2.1
  Top 1.016: 22.86,31.75 FU2.1 | L1.P$2 11.35,39.05
  Top 1.27: 11.35,39.05 C14.1
A2
  Top 0.254: U1.25 81.6,35.02 82.55,35.98 R38.2
A3  (via drill 0.4)
  Top 0.254: JP13.3 101.27,15.71 101.27,21.26 99.69,22.83 99.69,31.92 98.95,32.67 97.73,32.67 96.7,33.7 95.2,33.7 94.93,33.97 v84.77,33.97 | v80.96,39.68 R37.1
  Bottom 0.254: v84.77,33.97 85.41,34.6 85.41,38.1 84.77,38.73 81.92,38.73 v80.96,39.68
A4/SDA  (via drill 0.4)
  Top 0.254: R35.1 49.53,22.44 49.53,23.49 50.69,24.64 50.69,30.16 51.95,31.42 IC1.9 51.95,34.48 52.39,34.92 57.91,34.92 R11.2 58.22,35.16 58.48,35.48 60.96,35.48 61.44,35.96 v61.44,36.83 | v75.88,33.65 75.99,33.65 U1.27
  Bottom 0.254: v61.44,36.83 72.71,36.83 v75.88,33.65
A5/SCL  (via drill 0.4)
  Top 0.254: 59.69,34.57 59.69,33.02 59.37,32.7 53.02,32.7 52.59,33.13 IC1.10 52.45,30.54 51.49,29.52 51.49,23.39 50.8,22.69 R36.1 | 59.69,34.57 R14.2 | 59.69,34.57 v61.44,34.57 | v72.34,34.57 75.78,34.57 U1.28
  Bottom 0.254: v61.44,34.57 v72.34,34.57
BAT_U  (via drill 0.4)
  Top 0.254: R22.1 R23.2 54.57,27.35 D5.A | D5.A 53.08,26.98 | D5.A 53.34,27.77 v53.34,31.75 | v49.53,32.06 49.53,32.7 49.96,33.13 IC1.6
  Bottom 0.254: v53.34,31.75 53.02,32.06 v49.53,32.06
BAT_VOLTAGE
  Top 0.254: R21.2 53.85,21.46 46.9,21.46 46.58,21.78 46.58,25.29 45.72,26.16 38.67,26.16 38.16,26.67 33.02,26.67 29.46,23.11 SW1.2
  Power_5V 1.27: SW1.2 30.24,19.54 JP5.1
BRAKE
  Top 0.254: JP12.1 88.15,15.74 R24.2
BRAKE_PIN  (via drill 0.4)
  Top 0.254: U1.12 72.14,32.06 v73.66,32.06 | v73.66,26.35 76.35,23.66 83.88,23.66 R24.1 89.52,27.92 C16.2 89.97,27.94 SW2.4
  Bottom 0.254: v73.66,32.06 v73.66,26.35
BUTTON1
  Top 0.254: JP7.3 51.83,19.66 R30.1
BUTTON2
  Top 0.254: JP8.2 57.54,19.36 R31.1
CSIG  (via drill 0.4)
  Top 0.254: R42.1 41.87,21.55 43.18,22.86 v43.18,25.4 | v43.18,29.21 45.09,31.11 45.09,37.46 46.1,38.48 49.72,38.48 50.45,37.75 IC1.5
  Bottom 0.254: v43.18,25.4 43.94,26.16 43.94,28.44 v43.18,29.21
CURRENT_SIG
  Top 0.254: JP6.2 41.03,19.73 R42.2
DTR
  Top 0.254: JP14.6 101.6,40 100.33,38.73 96.94,38.73 C3.1
GND  (via drill 0.3, 0.4, 0.6)
  Top 0.254: C6.1 64.01,32.89 v62.99,33.52 | C5.1 65.51,30.37 v66.04,29.84 | U1.3 71.14,39.14 C20.2 70.82,40.13 v70.05,40 | v67.31,38.73 67.56,38.73 C7.2 68.96,37.33 70.68,37.33 U1.5 | U1.21 78.83,30.31 C2.2 78.83,29.49 v79.45,28.88 | R3.2 v0.76,38.86 | C13.1 20.83,26.31 v20.83,26.41 | R20.2 | R1.1 v23.75,41.14 | R2.1 46.67,29.31 46.35,29.52 v46.35,30.79 47.31,30.79 C15.1 | C1.2 51.12,35.87 51.44,36.19 51.44,37.52 IC1.3 | C19.1 61.21,24.27 v61.21,25.27 | v66.99,21.9 67.18,21.72 C8.- | R44.1 72.49,20 v73.66,20 | R25.1 89.53,25.18 v89.48,25.23 89.48,26.18 C16.1 | R9.2 93.2,19.77 | 93.2,19.77 v93.42,19.76 | C17.1 86.82,25.29 v86.84,25.32 | C18.1 98.53,25.64 v98.53,26.64 | JP13.2 98.82,18.52 R28.1 | 93.2,19.77 R8.2 | C4.2 80.33,29.52 v80.33,29.88 | 56.37,39.87 R4.2 56.46,40.02 v56.46,41.02 | v57.78,29.21 v57.78,28.25 56.83,27.3 R23.1
  Top 0.305: v13.97,24.13 v13.97,25.08 | v15.88,25.08 v15.88,24.13
  Top 0.406: R20.2 19.05,33.65 | C11.2 8.39,26.03 | v14.67,21.59 14.67,20.38 14.61,20.32 R19.2 | v78.46,40.81 77.36,40.81 C21.2
  Top 0.61: v13.97,23.17 IC2.9 | IC2.9 v15.88,23.17 | v15.88,25.08 IC2.9 | IC2.9 v13.97,25.08 | v14.92,25.08 13.97,26.03 IC2.1 | IC2.1 12.38,26.03 | 8.39,26.03 IC2.1 | v25.15,39.87 25.15,40.38 | 25.15,40.38 v25.15,41.02 | C10.- 26.48,40.38 25.15,40.38 | v28.57,38.48 28.57,37.84 | 28.57,37.84 v28.57,37.33 | C9.- 27.12,37.84 28.57,37.84 | v29.72,37.72 v29.72,38.73 32.3,38.73 IC3.1 | v43.05,28.06 43.05,27.56 | 43.05,27.56 v43.05,27.05 | R32.1 43.05,27.56 | v48.13,37.21 48.13,35.89 C1.2 | 5.08,25.71 8.57,25.71 8.57,25.58 C11.2 | v17.65,34.03 17.65,33.5 | 17.65,33.5 17.65,32.89 | R20.2 18.95,33.5 17.65,33.5
  Top 0.813: IC2.9 v14.92,25.08 | v5.71,27.94 5.08,27.94 | 5.08,27.94 v4.45,27.94 | TS1.A 5.08,25.95 5.08,27.94 | v4.57,34.92 4.57,34.29 | 4.57,34.29 v4.57,33.52 | TS3.A 4.57,34.29 | v35.18,22.48 v34.04,22.48 34.29,22.73 TS2.A | v43.18,21.59 v44.45,21.59 45.03,22.17 D3.A
  GND 0.254: v66.04,29.84 67.31,29.84 | v67.31,38.73 67.44,38.73
  other vias: 14.92,24.13 14.92,23.17 17.65,32.94 63,35.72 76.34,32.6 60.78,33.52 72.85,33.52 68.43,32.91 69.98,28.77 82.45,30.04 84.23,22.53 94.36,33.17 10.57,21.64 48.34,32.15 54.56,31.85 75.18,35.51 77.37,33.24 74.93,31.75 71.12,25.57 72.16,25.55 79.83,39.62 83.59,33.65 86.18,37.82 5.17,19.35 7.87,18.11 31.48,17.34 34.09,17.98 64.01,29.1 64.11,26.51 96.47,18.06 83.69,38.05 84.76,41.12 87.25,41.14 89.81,41.12 88.34,32.18 92.38,41.12 96.06,27.17 60.96,38.1
  pour GND (isolate 0.203): -1.27,43.18 105.41,43.18 105.41,6.98 -1.27,6.98
  pour Bottom (isolate 0.203, rank 2): -0.64,42.22 104.78,42.22 104.78,6.66 -0.64,6.66
MISO  (via drill 0.4)
  Top 0.254: U1.16 76.95,25.56 83.35,25.56 84.77,26.98 v84.77,31.75
  Bottom 0.254: JP15.2 88.58,39.37 87.95,38.73 87.95,34.92 v84.77,31.75
MOSI  (via drill 0.4)
  Top 0.254: U1.15 72.39,28.92 72.39,28.57 73.34,27.62 73.66,27.62 76.67,24.61 83.67,24.61 86.68,27.62 v86.68,31.75
  Bottom 0.254: JP15.3 91.12,39.68 89.53,38.1 89.53,34.6 v86.68,31.75
N$1
  Top 0.254: R2.2 44.77,29.11 LED1.C
N$2
  Top 0.254: JP7.1 46.67,15.69 46.67,18.09 47.31,18.73 48.58,18.73 49.21,19.36 49.21,20.42 R35.2
N$3  (via drill 0.4)
  Top 0.254: R3.1 R16.2 4.95,37.08 5.59,36.45 5.59,30.1 v6.99,28.7 | v10.54,22.73 11.3,23.49 IC2.3
  Bottom 0.254: v10.54,22.73 8.38,22.73 6.99,24.13 v6.99,28.7
N$4
  Top 0.254: JP7.2 49.21,15.69 49.21,17.78 50.8,19.36 R36.2
N$5
  Top 0.254: D9.1 71.02,26.67 R33.1
N$6
  Top 0.254: IC2.7 18.54,24.76 18.92,25.14 18.92,27.81 C12.1
N$7  (via drill 0.4)
  Top 0.254: v68.71,31.87 68.71,32.02 U1.9 | R7.1 68.36,23.39 | 68.36,23.39 66.67,25.08 66.67,26.41 v70.36,30.1 | R44.2 72.39,22.86 71.75,23.49 68.47,23.49 68.36,23.39
  Bottom 0.254: v70.36,30.1 70.36,30.22 v68.71,31.87
N$8
  Top 0.254: U1.20 77.72,30.29 77.72,29.59 79.73,27.58 C4.1
N$9
  Top 0.254: R1.2 LED2.C
N$10  (via drill 0.4)
  Top 0.254: R15.2 80.96,21.85 80.96,22.54 80.64,22.86 75.88,22.86 72.39,26.35 72.39,27.38 v72.21,27.56 | U1.32 71.44,34.75 v71.44,33.33
  Bottom 0.254: v72.21,27.56 72.21,32.56 v71.44,33.33
N$11
  Top 0.254: IC1.1 52.45,39.43 53.02,40 54.6,40 R4.1
N$12
  Top 0.254: IC1.2 51.95,36.31 52.39,35.87 54.72,35.87 R5.1
N$13
  Top 0.254: D4.1 65.43,38.85 R34.1
N$15
  Top 0.254: 48.41,39.88 R41.2 48.44,40 50.48,40 50.95,39.54 IC1.4
N$17  (via drill 0.4)
  Top 0.254: R29.2 36.83,17.78 36.83,11.43 38.1,10.16 95.33,10.16 97.54,12.37 97.54,17.8 v97.56,18.18 | R45.2 v95.25,34.92 83.5,34.92 82.55,33.97 v78.11,33.97 | v75.88,36.19 75.88,36.94 U1.30
  Bottom 0.254: v97.56,18.18 97.56,32.61 v95.25,34.92 | v78.11,33.97 v75.88,36.19
N$18
  Top 0.61: D2.2 40.39,29.71 39.88,29.21 39.88,27.62 R32.2
N$19
  Top 0.254: R25.2 90.07,23.06 SW2.1
N$20
  Top 0.254: R30.2 54.61,20 55.56,20.95 57.78,20.95 58.42,21.59 58.42,26.03 60.64,28.25 66.36,28.25 68.26,30.16 68.26,30.45 U1.10
N$21
  Top 0.254: R31.2 59.78,19.77 60.01,20 60.01,25.71 61.59,27.3 66.52,27.3 69.22,29.99 69.22,30.16 70.73,31.67 U1.11
N$22
  Top 0.254: R26.1 95.9,31.33 SW2.3
N$23
  Top 0.254: R17.1 8.56,20.67 C11.1 | R16.1 0.64,35.9 0.64,32.76 2.54,30.86 TS3.C
  Top 0.406: TS1.C 5.52,22.16
  Top 0.61: IC2.2 10.56,24.76 C11.1 6.13,22.76 5.52,22.16 | TS1.C 1.8,24.92 FU1.2 2.54,28.18 TS3.C
N$24
  Top 0.254: R33.2 71.12,29.91 U1.13
N$25
  Top 0.254: R34.2 68.1,40.03 68.83,40.76 71.63,40.76 72.52,39.87 72.52,38.89 U1.2
N$26
  Top 0.254: U1.7 69.69,36.06 68.83,36.06 68.58,35.81 66.04,35.81 65.51,35.28 X1.3 65.26,34.5 C6.2
N$27
  Top 0.254: U1.8 67.21,32.63 X1.1 C5.2
N$30
  Top 0.254: R21.1 R22.2
N$31
  Top 0.254: U1.26 80.08,36.61 R37.2
N$32
  Top 0.254: R38.1 82.55,39.68 A2.1
PAS_SIG
  Top 0.254: PAS.1 77.05,20.1 R13.1 79.39,20.11 R15.1 82.31,18.73 JP11.2
RESET  (via drill 0.4)
  Top 0.254: C3.2 R6.2 92.81,36.29 v92.39,35.87 84.77,35.87 83.19,37.46 80.01,37.46 79.38,38.1 78.11,38.1 77.36,37.36 U1.29
  Bottom 0.254: JP15.5 96.2,39.68 95.57,39.05 92.41,35.87 v92.39,35.87
RX
  Top 0.254: JP2.2 13.03,13.64 13.97,12.7 27.69,12.7 28.7,13.71 28.7,17.14 29.59,18.03 31.24,18.03 R29.1
RX_2
  Top 0.254: R45.1 JP14.4
SCK  (via drill 0.4)
  Top 0.254: U1.17 75.67,28.79 78.11,26.35 82.55,26.35 83.5,27.3 v83.5,30.16
  Bottom 0.254: JP15.4 93.65,39.85 90.81,37 90.81,33.33 87.63,30.16 v83.5,30.16
SPEED_PIN  (via drill 0.4)
  Top 0.254: R10.2 63.03,22.59 63.03,22.72 63.09,22.78 C19.2 63.08,24.29 63.04,24.33 63.04,24.43 63.02,24.46 63.03,26.63 v63.04,26.49 | v63.04,29.16 63.04,31.89 62.23,32.7 62.23,39.68 63.82,41.27 72.1,41.27 73.37,40 73.37,39.25 U1.1
  Bottom 0.254: v63.04,26.49 v63.04,29.16
SPEED_SIG
  Top 0.254: JP9.1 61.38,17.5 R12.1 R10.1
SW
  Top 0.406: IC2.8 17.58,29.41
  Top 0.61: 10.48,28.57 10.16,28.25 10.06,28.25 L1.P$1 | 17.14,29.84 C12.2 | 17.14,29.84 13.02,29.84 | 17.58,29.41 17.14,29.84
  pour Top (no thermals): 10.48,27.8 10.48,29.84 16.19,29.84 16.51,30.48 18.41,30.48 18.41,29.21 17.78,29.21 17.78,26.03 16.83,26.03 16.83,27.8
T1  (via drill 0.4)
  Top 0.254: 86.88,22.5 C17.2 | C17.2 85.5,22.57 84.77,23.29 v84.77,23.49 | R39.2 86.82,21.49 C17.2 | U1.23 79.09,32.35 v82.55,28.89
  Bottom 0.254: 84.45,23.81 v84.77,23.49 82.55,25.71 v82.55,28.89
T2
  Top 0.254: R40.2 98.49,22.5 98.49,22.69 98.42,22.75 C18.2 98.02,23.9 93.98,27.94 93.98,32.38 93.45,32.91 U1.24
TEMP_1
  Top 0.254: R9.1 90.23,19.77 R39.1 | JP12.2 90.56,19.59 R9.1 | SW2.2 95.25,22.7 93.4,20.85 91.47,20.85 R9.1
TEMP_2
  Top 0.254: 98.22,20.74 R40.1 97.38,20.74 R8.1 95.89,19.24 95.89,18.86 93.1,15.95 JP12.3
THR_IN_SIG
  Top 0.254: JP10.2 74.05,12.46 73.03,11.43 46.04,11.43 45.09,12.38 45.09,19.68 46.04,20.63 47.98,20.63 R43.2
THR_OUT
  Top 0.254: JP9.3 69.98,17.26 C8.+ 70.06,20.4 R7.2
TSIG
  Top 0.254: IC1.7 50.95,31.67 50.43,31.15 49.04,31.15 C15.2 49.21,30.68 49.21,25.4 47.69,23.87 R43.1
TX  (via drill 0.4)
  Top 0.254: R27.2 100.65,25.61 100.65,32.38 99.38,33.65 98.11,33.65 97.66,34.1 97.66,36.06 98.21,36.61 R46.2 97.89,37.14 84.77,37.14 v84.45,37.46 | v77.79,39.37 77.18,39.37 U1.31
  Bottom 0.254: v84.45,37.46 83.82,37.14 80.01,37.14 v77.79,39.37
TX_2
  Top 0.254: R46.1 JP14.5
TX_3.3
  Top 0.254: JP2.1 10.49,12.37 13.97,8.89 99.38,8.89 102.87,12.38 102.87,19.4 R28.2 102.23,20.24 R27.1
VDD
  Top 0.254: IC1.8 51.44,33.14 51.44,34.29 51.12,34.6 48.58,34.6 C1.1
  Top 0.406: F1.1 48.03,34.06 C1.1
VIN
  Top 0.61: FU1.1 4.75,16.87 | SW1.1 26.92,23.11 29.46,25.65 SW1.3
  Top 1.016: 4.75,16.87 JP1.1
  Power_5V 1.27: SW1.1 8.19,20.32 4.75,16.87 JP1.1
VIN_V
  Power_5V 1.016: JP5.2 32.7,15.69
  Power_5V 1.27: 32.7,15.69 32.7,20.32 32.7,20.63 26.92,26.41 SW1.4
  Bottom 1.27: JP1.2 7.29,12.26 9.14,10.41 30.99,10.41 32.77,12.19 32.77,15.6 JP5.2

### Text on the board
tNames: JLCJLCJLCJLC | ebikecomputer.com | A | L | 1 | + | 2 | - | MPe v6.8 | 1 | 2 | 3 | 4 | 5 | 6 | 7 | 8 | 9 | 10 | 11 | 12 | 13 | 14 | 15 | 16 | 17 | 18 | 19 | 20 | 21 | 22 | 23 | 24 | 25 | 26 | 27 | 28 | 29 | 30 | 31 | 32 | 33 | 34 | 35 | 36